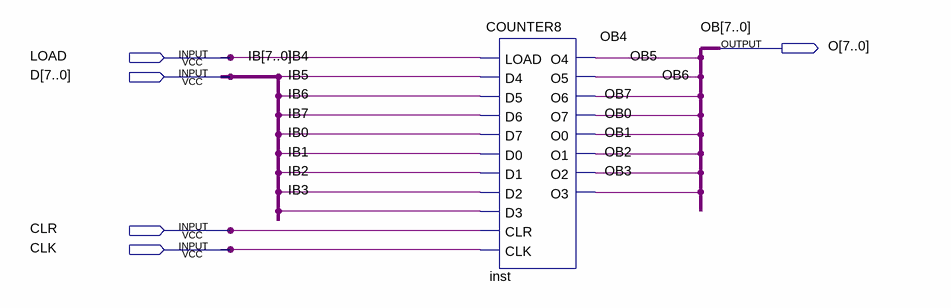
[diagram p0: schematic sheet]
// Quartus schematic CONTER8-B.bdf as structural Verilog: 1 symbols, 5 pins
module \CONTER8-B  (
  input  LOAD,
  input  [7:0] D,
  input  CLR,
  input  CLK,
  output [7:0] O
);

  COUNTER8 inst (
    .LOAD(LOAD), .D4(D[4]), .D5(D[5]), .D6(D[6]), .D7(D[7]), .D0(D[0]), .D1(D[1]), .D2(D[2]), .D3(D[3]),
    .CLR(CLR), .CLK(CLK), .O4(O[4]), .O5(O[5]), .O6(O[6]), .O7(O[7]), .O0(O[0]), .O1(O[1]), .O2(O[2]),
    .O3(O[3]));

  // Other names for the same wires on the sheet: IB[7:0] = D; IB0 = D[0]; IB1 = D[1]; IB2 = D[2]; IB3 = D[3];
  //   IB4 = D[4]; IB5 = D[5]; IB6 = D[6]; IB7 = D[7]; OB[7:0] = O; OB0 = O[0]; OB1 = O[1]; OB2 = O[2]; OB3 = O[3];
  //   OB4 = O[4]; OB5 = O[5]; OB6 = O[6]; OB7 = O[7]
endmodule
